# EAGLE board moteus_n1 (EAGLE 9.6.0), part 1 of 2
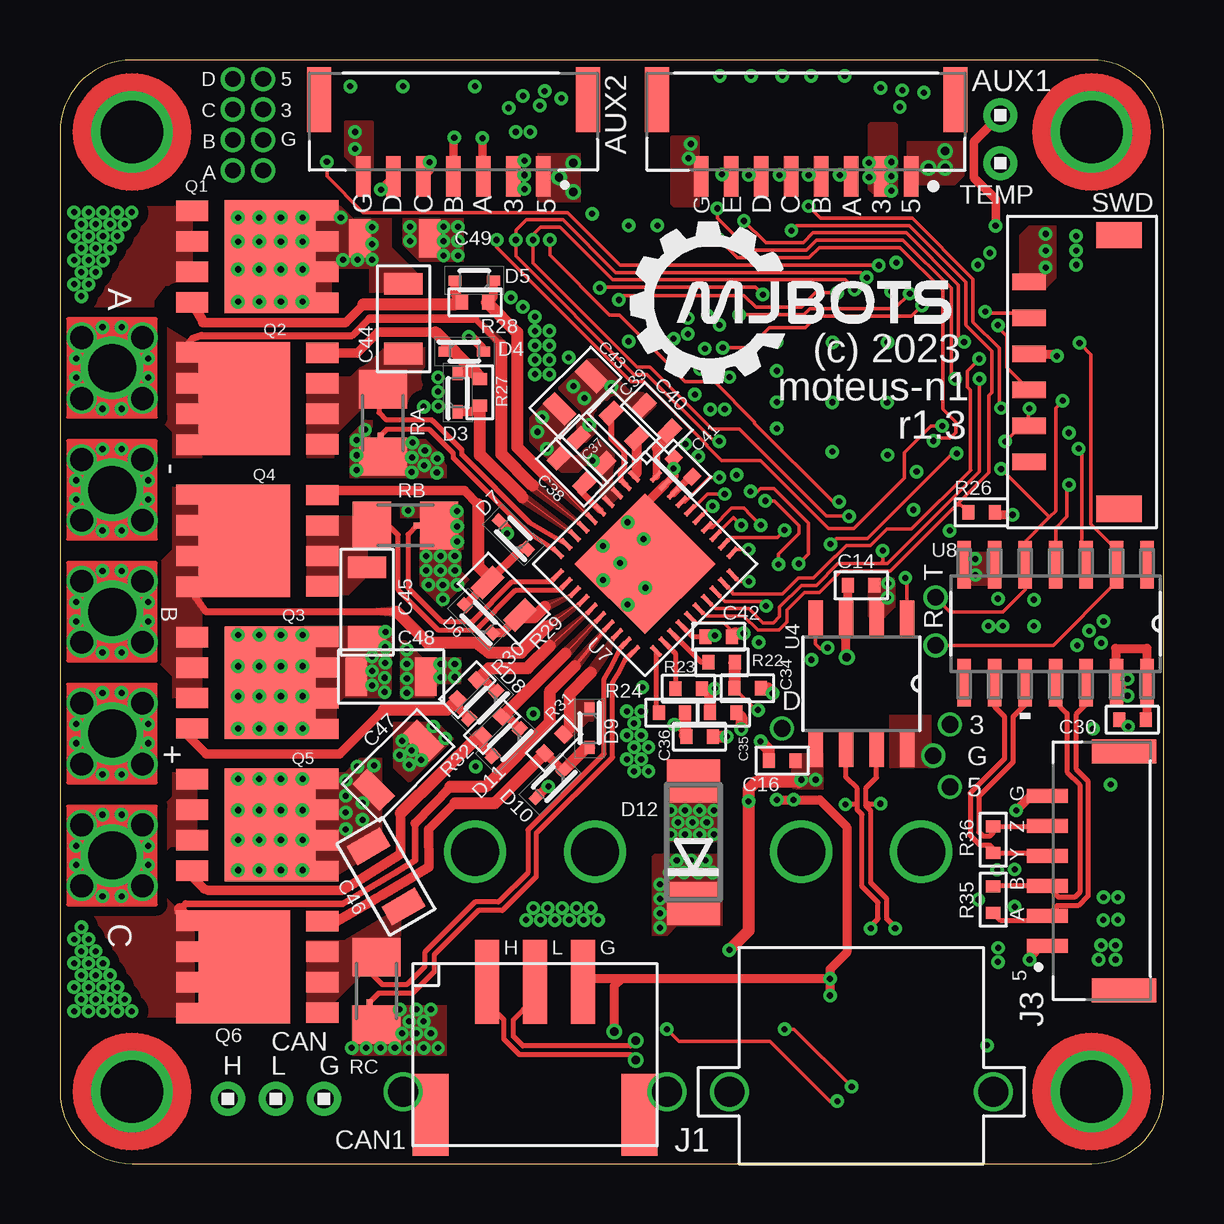
[diagram p8: board, top side]
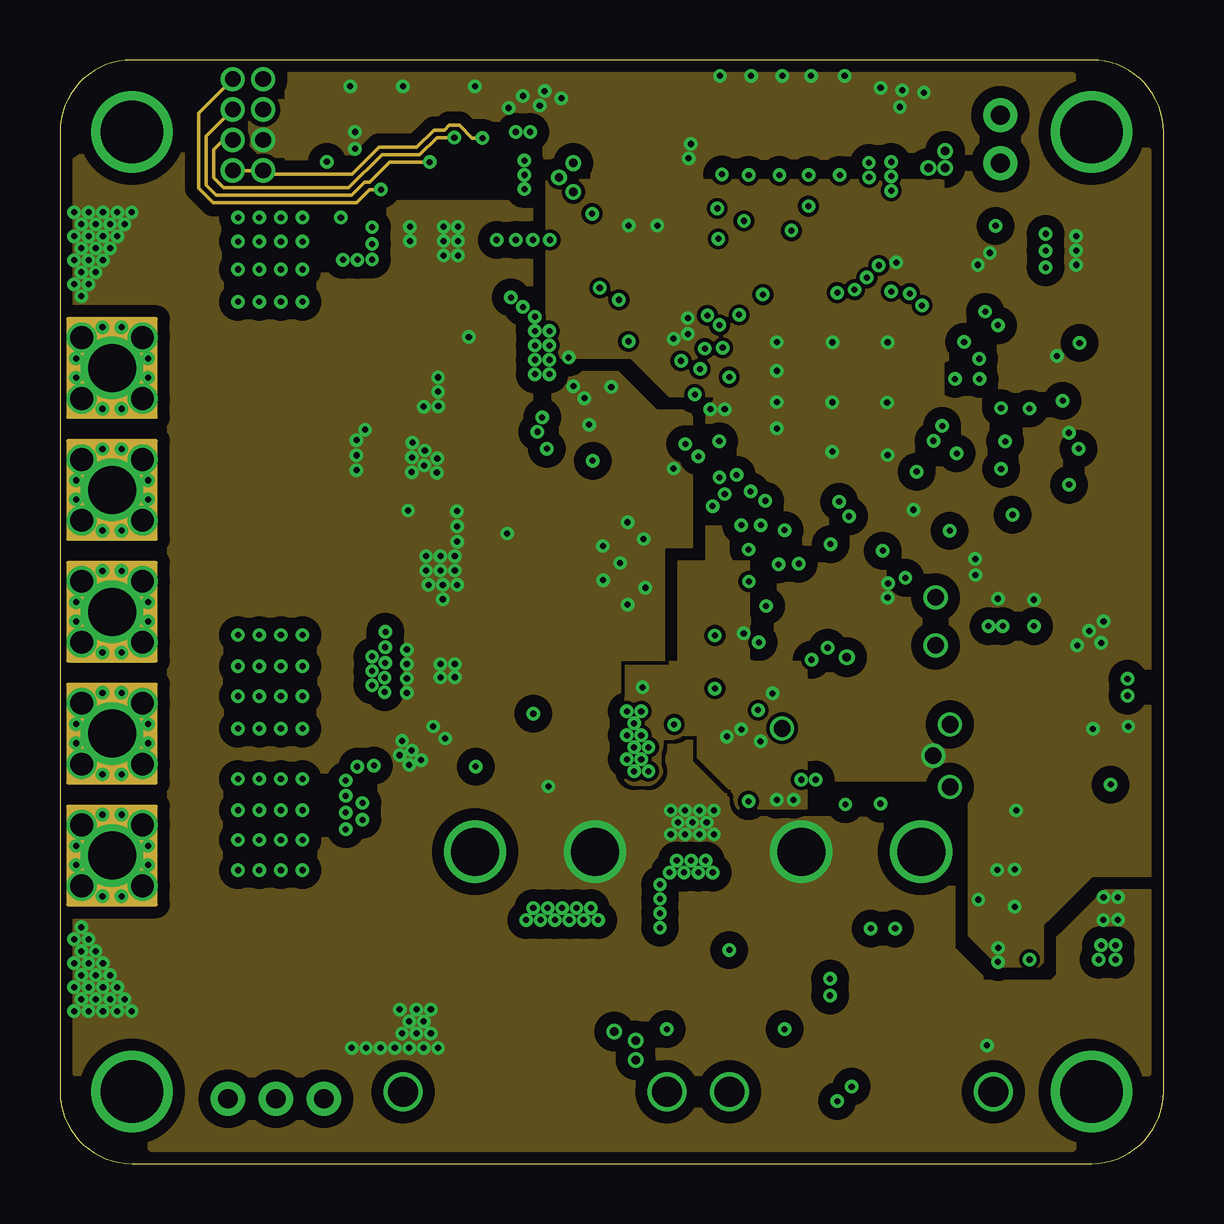
[diagram p9: board, inner layer Route2]
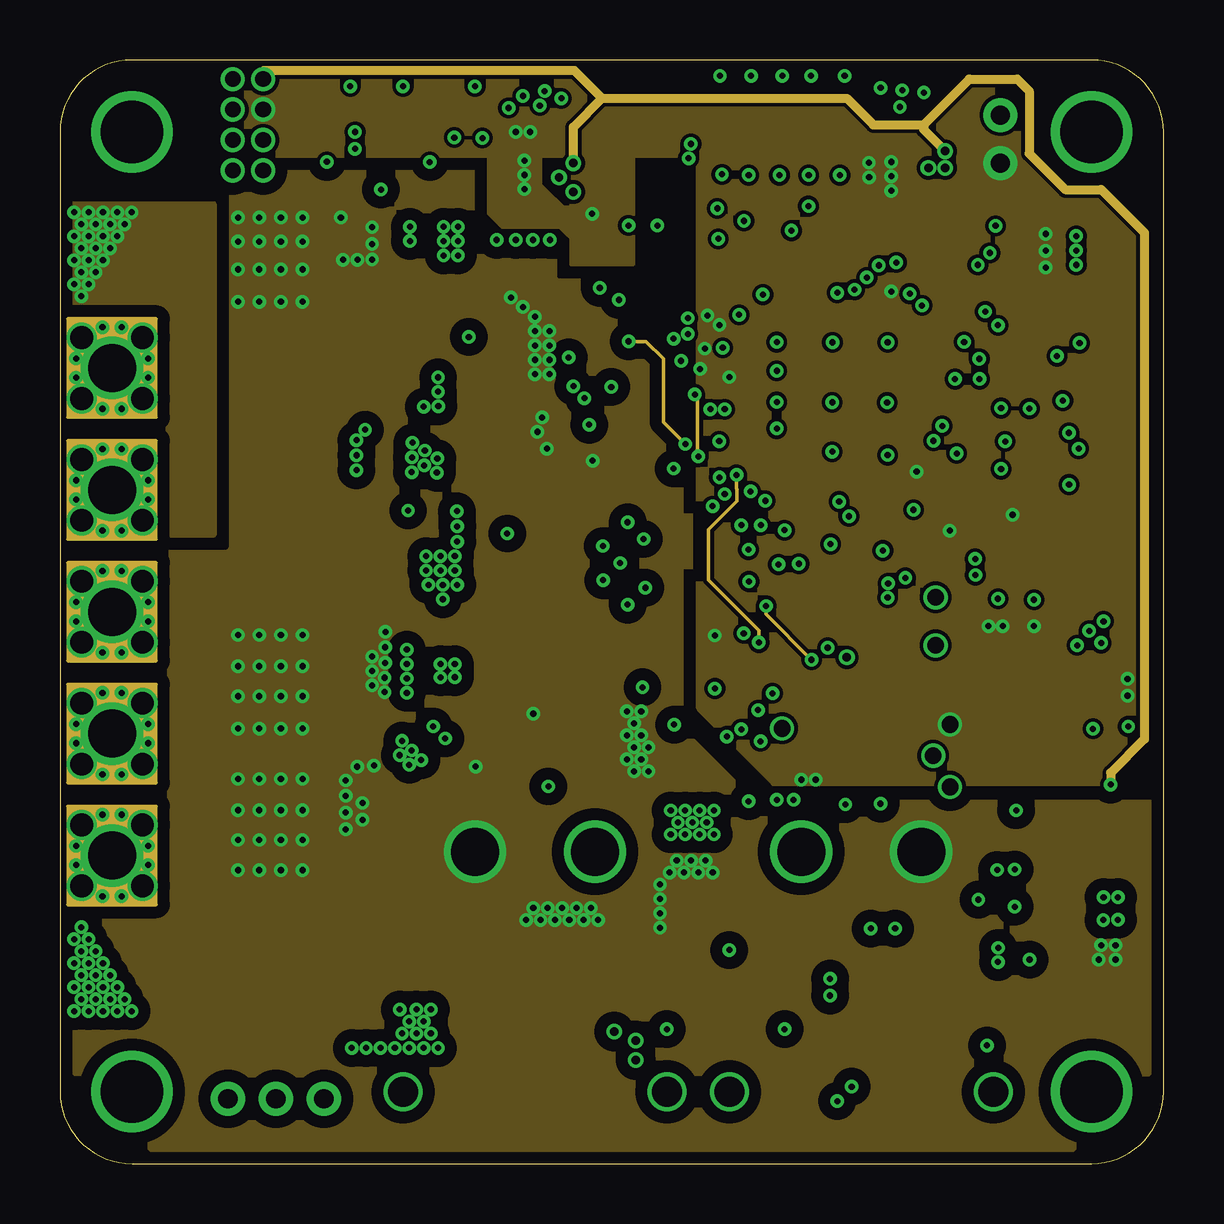
[diagram p10: board, inner layer Route15]
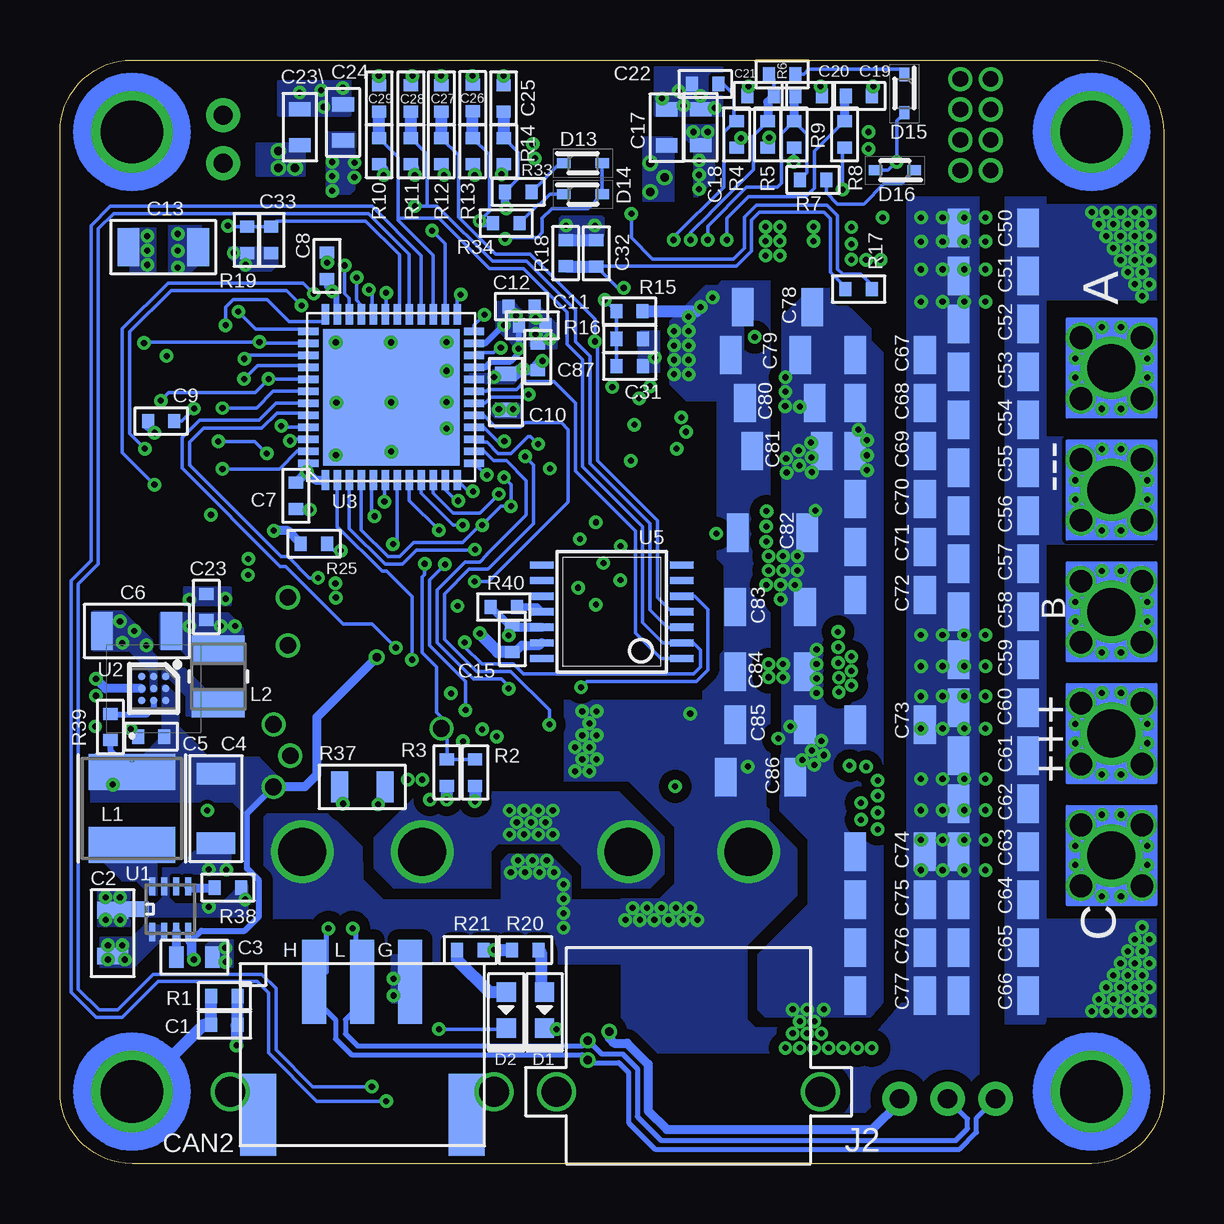
[diagram p11: board, bottom side, seen from below]

Size 46 x 46 mm. Coordinates in mm from the lower left corner, seen from the top.
Outline: 0,43 0,3 arc90 3,0 43,0 arc90 46,3 46,43 arc90 43,46 3,46 arc90 0,43
Copper layers (1*2*15*16): Top 0.07mm / dielectric 0.23mm / Route2 0.035mm / dielectric 0.93mm / Route15 0.035mm / dielectric 0.23mm / Bottom 0.07mm
Design rules "MF_4_mil_drill_4_Layer *": minimum track width 6mil, minimum drill 10mil, track to track 6mil, track to pad 6mil, pad to pad 6mil, via to via 6mil, smd to smd 0mil, copper to edge 10mil, drill to drill 10mil, minimum pad ring 6mil, minimum via ring 6mil, stop-mask expansion 2mil, vias tented up to drill 25mil, thermal gap 10mil
Net classes: 0 default: width 0.127 mm; 1 CAN: width 0.216 mm, clearance 0.127 mm; 2 HV: clearance 0.13 mm; 3 GATE: width 0.384 mm

## Footprints (pad centres in the part's own frame; a part is rotated, then mirrored left to right if it is on the bottom)
16AWG_TERM = drill 2: 1 0,0 | drill 0.254: 2 -1.7,0.4; 3 -1.7,-0.4; 4 1.7,0.4; 5 1.7,-0.4; 6 -0.4,1.5; 7 0.4,1.5; 8 -0.4,-1.5; 9 0.4,-1.5 | drill 0.95 pad 1.255: 10 -1.27,1.27; 11 1.27,1.27; 12 -1.27,-1.27; 13 1.27,-1.27
JST_SM08B-GHS-TB(LF)(SN) = smd 0.6 x 1.7: 1 -4.375,0; 2 -3.125,0; 3 -1.875,0; 4 -0.625,0; 5 0.625,0; 6 1.875,0; 7 3.125,0; 8 4.375,0 | smd 1 x 2.7: SH1 -6.225,-3.2; SH2 6.225,-3.2
JST_SM07B-GHS-TB(LF)(SN) = smd 0.6 x 1.7: 1 -3.75,1.85; 2 -2.5,1.85; 3 -1.25,1.85; 4 0,1.85; 5 1.25,1.85; 6 2.5,1.85; 7 3.75,1.85 | smd 1 x 2.7: S1 5.6,-1.35; S2 -5.6,-1.35
PH2X4 = drill 0.65 pad 1.016: P$1 0,0; P$2 1.27,0; P$3 0,-1.27; P$4 1.27,-1.27; P$5 0,-2.54; P$6 1.27,-2.54; P$7 0,-3.81; P$8 1.27,-3.81
C0402 = smd 0.5 x 0.6: P$1 -0.55,0; P$2 0.55,0
C0805 = smd 0.7 x 1.3: P$1 -0.95,0; P$2 0.95,0
C0603 = smd 0.6 x 0.9: P$1 -0.75,0; P$2 0.75,0
C1206 = smd 0.9 x 1.6: P$1 -1.45,0; P$2 1.45,0
C1206_NOBORDER = smd 0.9 x 1.6: P$1 -1.45,0; P$2 1.45,0
JST_S3B-PH-SM4-TB(LF)(SN) = smd 1 x 3.5: 1 2,-2.98; 2 0,-2.98; 3 -2,-2.98 | smd 1.5 x 3.4: S1 -4.35,2.57; S2 4.35,2.57
1X3 = drill 0.8 pad 1.422: 1 -2,0; 2 0,0; 3 2,0
LED0603 = smd 0.8 x 0.8: ANODE 0.75,0; CATHODE -0.75,0
SODFL1608X70N = smd 0.55 x 0.42: 1 -0.8,0; 2 0.8,0
DO214AA = smd 1.8 x 2.2: A 2.55,0; C -2.55,0
24AWG_PAD = drill 0.7: P$1 0,0
XT30PW_MALE = drill 2: 1 -2.5,0; 2 2.5,0 | drill 1.25: M1 -5.5,10; M2 5.5,10
JST_SM06B-GHS-TB(LF)(SN) = smd 0.6 x 1.7: 1 -3.125,1.85; 2 -1.875,1.85; 3 -0.625,1.85; 4 0.625,1.85; 5 1.875,1.85; 6 3.125,1.85 | smd 1 x 2.7: S1 4.975,-1.35; S2 -4.975,-1.35
IND_BOURNS_SRN4018 = smd 1.499 x 3.607: 1 -1.524,0; 2 1.524,0
IND_1008_WE-PMI_WRE = smd 1.168 x 2.21: 1 -1.118,0; 2 1.118,0
M2.5MOUNT = drill 2.6: P$1 0,0
SOP_ADVANCE_8_VIAS = smd 0.85 x 1.35: 1 -1.905,-2.9; 2 -0.635,-2.9; 3 0.635,-2.9; 4 1.905,-2.9 | smd 0.85 x 1: 5 1.925,2.7; 6 0.637,2.7; 7 -0.637,2.7; 8 -1.925,2.7 | smd 4.7 x 3.8: PAD 0,0.35
SOP_ADVANCE_8 = smd 0.85 x 1.35: 1 -1.905,-2.9; 2 -0.635,-2.9; 3 0.635,-2.9; 4 1.905,-2.9 | smd 0.85 x 1: 5 1.925,2.7; 6 0.637,2.7; 7 -0.637,2.7; 8 -1.925,2.7 | smd 4.7 x 3.8: PAD 0,0.35
R0402 = smd 0.5 x 0.6: P$1 -0.55,0; P$2 0.55,0
R0805 = smd 0.7 x 1.3: P$1 -0.95,0; P$2 0.95,0
M1206 = smd 1.6 x 2: 1 -1.4,0; 2 1.4,0
SHORT_TOP-50 = smd 0.254 x 0.254: 1 0.127,0; 2 -0.127,0
SHORT_TOP-MEDIUM = smd 0.635 x 0.635: 1 0.318,0; 2 -0.318,0
JST_S6B-ZR-SM4A-TF(LF)(SN) = smd 0.7 x 1.4: 1 3.75,0; 2 2.25,0; 3 0.75,0; 4 -0.75,0; 5 -2.25,0; 6 -3.75,0 | smd 1.1 x 1.9: P1 5.7,3.75; P2 -5.7,3.75
1X2 = drill 0.8 pad 1.422: 1 -1,0; 2 1,0
21-0487A_MXM = smd 0.762 x 0.254: 1 -0.953,0.75; 2 -0.953,0.25; 3 -0.953,-0.25; 4 -0.953,-0.75; 5 0.953,-0.75; 6 0.953,-0.25; 7 0.953,0.25; 8 0.953,0.75
BGA9C50P3X3_165X187X66 = smd 0.306 x 0.306: A1 -0.5,0.5; A2 0,0.5; A3 0.5,0.5; B1 -0.5,0; B2 0,0; B3 0.5,0; C1 -0.5,-0.5; C2 0,-0.5; C3 0.5,-0.5
QFN50P700X700X60-49N = smd 0.85 x 0.3: 1 -3.45,2.75; 2 -3.45,2.25; 3 -3.45,1.75; 4 -3.45,1.25; 5 -3.45,0.75; 6 -3.45,0.25; 7 -3.45,-0.25; 8 -3.45,-0.75; 9 -3.45,-1.25; 10 -3.45,-1.75; 11 -3.45,-2.25; 12 -3.45,-2.75; 25 3.45,-2.75; 26 3.45,-2.25; 27 3.45,-1.75; 28 3.45,-1.25; 29 3.45,-0.75; 30 3.45,-0.25; 31 3.45,0.25; 32 3.45,0.75; 33 3.45,1.25; 34 3.45,1.75; 35 3.45,2.25; 36 3.45,2.75 | smd 0.3 x 0.85: 13 -2.75,-3.45; 14 -2.25,-3.45; 15 -1.75,-3.45; 16 -1.25,-3.45; 17 -0.75,-3.45; 18 -0.25,-3.45; 19 0.25,-3.45; 20 0.75,-3.45; 21 1.25,-3.45; 22 1.75,-3.45; 23 2.25,-3.45; 24 2.75,-3.45; 37 2.75,3.45; 38 2.25,3.45; 39 1.75,3.45; 40 1.25,3.45; 41 0.75,3.45; 42 0.25,3.45; 43 -0.25,3.45; 44 -0.75,3.45; 45 -1.25,3.45; 46 -1.75,3.45; 47 -2.25,3.45; 48 -2.75,3.45 | smd 5.7 x 5.7: 49 0,0
SOIC8 = smd 1.549 x 0.61: 1 -2.7,1.905; 2 -2.7,0.635; 3 -2.7,-0.635; 4 -2.7,-1.905; 5 2.7,-1.905; 6 2.7,-0.635; 7 2.7,0.635; 8 2.7,1.905
TSSOP14 = smd 0.305 x 0.991: 1 -1.95,-2.918; 2 -1.3,-2.918; 3 -0.65,-2.918; 4 0,-2.918; 5 0.65,-2.918; 6 1.3,-2.918; 7 1.95,-2.918; 8 1.95,2.918; 9 1.3,2.918; 10 0.65,2.918; 11 0,2.918; 12 -0.65,2.918; 13 -1.3,2.918; 14 -1.95,2.918
WQFN-40 = smd 0.22 x 0.6: 1 2.25,2.9; 2 1.75,2.9; 3 1.25,2.9; 4 0.75,2.9; 5 0.25,2.9; 6 -0.25,2.9; 7 -0.75,2.9; 8 -1.25,2.9; 9 -1.75,2.9; 10 -2.25,2.9; 21 -2.25,-2.9; 22 -1.75,-2.9; 23 -1.25,-2.9; 24 -0.75,-2.9; 25 -0.25,-2.9; 26 0.25,-2.9; 27 0.75,-2.9; 28 1.25,-2.9; 29 1.75,-2.9; 30 2.25,-2.9 | smd 0.6 x 0.22: 11 -2.9,2.25; 12 -2.9,1.75; 13 -2.9,1.25; 14 -2.9,0.75; 15 -2.9,0.25; 16 -2.9,-0.25; 17 -2.9,-0.75; 18 -2.9,-1.25; 19 -2.9,-1.75; 20 -2.9,-2.25; 31 2.9,-2.25; 32 2.9,-1.75; 33 2.9,-1.25; 34 2.9,-0.75; 35 2.9,-0.25; 36 2.9,0.25; 37 2.9,0.75; 38 2.9,1.25; 39 2.9,1.75; 40 2.9,2.25 | smd 4.15 x 4.15: PAD 0,0
D14 = smd 1.981 x 0.559: 1 -2.464,3.81; 2 -2.464,2.54; 3 -2.464,1.27; 4 -2.464,0; 5 -2.464,-1.27; 6 -2.464,-2.54; 7 -2.464,-3.81; 8 2.464,-3.81; 9 2.464,-2.54; 10 2.464,-1.27; 11 2.464,0; 12 2.464,1.27; 13 2.464,2.54; 14 2.464,3.81

## Placement (x,y rotation side)
A  PAD16AWG_TERM  [16AWG_TERM]  2.17,33.16 90 bottom
AUX1  SM08B-GHS-TB(LF)(SN)  [JST_SM08B-GHS-TB(LF)(SN)]  31.1,41.15 180 top
AUX2  SM07B-GHS-TB(LF)(SN)  [JST_SM07B-GHS-TB(LF)(SN)]  16.4,43 180 top
AUX2H  PH2X4  [PH2X4]  7.2,45.2 0 top
B  PAD16AWG_TERM  [16AWG_TERM]  2.17,23 90 bottom
C  PAD16AWG_TERM  [16AWG_TERM]  2.17,12.84 90 bottom
C1  DNP  [C0402]  39.15,5.78 0 bottom
C2  1uF 100V  [C0805]  43.8,9.6 90 bottom
C3  1uF  [C0603]  40.4,8.6 0 bottom
C4  22uF  [C1206]  39.5,14.8 270 bottom
C5  1uF  [C0402]  42.2,17.8 180 bottom
C6  22uF  [C1206]  42.8,22.2 180 bottom
C7  0.1uF  [C0402]  36.16,27.83 270 bottom
C8  0.1uF  [C0402]  34.87,37.42 90 bottom
C9  0.1uF  [C0402]  41.78,30.95 180 bottom
C10  4.7uF  [C0603]  27.41,32.16 270 bottom
C11  1uF  [C0402]  26.31,34.94 0 bottom
C12  0.1uF  [C0402]  26.76,35.72 0 bottom
C13  10uF  [C1206]  41.69,38.2 0 bottom
C14  0.1uF  [C0402]  33.4,24.1 0 top
C15  0.1uF  [C0402]  27.14,21.87 270 bottom
C16  0.1uF  [C0402]  30.1,16.8 180 top
C17  1uF  [C0603]  20.71,43.18 90 bottom
C18  1uF  [C0603]  19.3,43.2 90 bottom
C19  DNP  [C0402]  12.7,44.5 0 bottom
C20  DNP  [C0402]  14.8,44.5 0 bottom
C21  DNP  [C0402]  16.8,44.5 180 bottom
C22  DNP  [C0402]  19.1,45 180 bottom
C23  1uF  [C0402]  39.9,23.2 90 bottom
C23\  1uF  [C0603]  36,43.2 90 bottom
C24  1uF  [C0603]  34.2,43.4 90 bottom
C25  DNP  [C0402]  27.51,44.4 90 bottom
C26  DNP  [C0402]  28.8,44.41 90 bottom
C27  DNP  [C0402]  30.1,44.4 90 bottom
C28  DNP  [C0402]  31.37,44.4 90 bottom
C29  DNP  [C0402]  32.7,44.4 90 bottom
C30  0.1uF  [C0402]  44.7,18.5 180 top
C31  0.01uF  [C0402]  22.25,33.24 0 bottom
C32  0.1uF  [C0402]  23.64,37.94 90 bottom
C33  0.1uF  [C0402]  37.2,38.5 270 bottom
C34  1000pF  [C0402]  28.66,19.81 0 top
C35  1000pF  [C0402]  27.65,18.79 0 top
C36  1000pF  [C0402]  26.66,17.79 0 top
C37  0.1uF 100V  [C0603]  22.14,29.71 135 top
C38  1uF  [C0603]  21.34,28.88 315 top
C39  0.1uF 100V  [C0603]  23.51,30.75 315 top
C40  1uF  [C0603]  24.88,31.07 315 top
C41  1uF  [C0402]  25.97,29.01 315 top
C42  0.1uF  [C0402]  27.46,21.96 180 top
C43  0.47uF 100V  [C0805]  21.49,32.13 45 top
C44  0.1uF 100V  [C1206]  14.32,35.21 270 top
C45  0.1uF 100V  [C1206]  12.8,23.4 90 top
C46  0.1uF 100V  [C1206]  13.59,11.97 300 top
C47  4.7uF 100V  [C1206]  14.1,16.6 45 top
C48  4.7uF 100V  [C1206]  13.8,20.3 0 top
C49  4.7uF 100V  [C1206_NOBORDER]  13.96,38.57 0 top
C50  4.7uF 100V  [C1206_NOBORDER]  7.1,39 0 bottom
C51  4.7uF 100V  [C1206_NOBORDER]  7.1,37 0 bottom
C52  4.7uF 100V  [C1206_NOBORDER]  7.1,35 0 bottom
C53  4.7uF 100V  [C1206_NOBORDER]  7.1,33 0 bottom
C54  4.7uF 100V  [C1206_NOBORDER]  7.1,31 0 bottom
C55  4.7uF 100V  [C1206_NOBORDER]  7.1,29 0 bottom
C56  4.7uF 100V  [C1206_NOBORDER]  7.1,27 0 bottom
C57  4.7uF 100V  [C1206_NOBORDER]  7.1,25 0 bottom
C58  4.7uF 100V  [C1206_NOBORDER]  7.1,23 0 bottom
C59  4.7uF 100V  [C1206_NOBORDER]  7.1,21 0 bottom
C60  4.7uF 100V  [C1206_NOBORDER]  7.1,19 0 bottom
C61  4.7uF 100V  [C1206_NOBORDER]  7.1,17 0 bottom
C62  4.7uF 100V  [C1206_NOBORDER]  7.1,15 0 bottom
C63  4.7uF 100V  [C1206_NOBORDER]  7.1,13 0 bottom
C64  4.7uF 100V  [C1206_NOBORDER]  7.1,11 0 bottom
C65  4.7uF 100V  [C1206_NOBORDER]  7.1,9 0 bottom
C66  4.7uF 100V  [C1206_NOBORDER]  7.1,7 0 bottom
C67  4.7uF 100V  [C1206_NOBORDER]  11.4,33.7 180 bottom
C68  4.7uF 100V  [C1206_NOBORDER]  11.4,31.7 180 bottom
C69  4.7uF 100V  [C1206_NOBORDER]  11.4,29.7 180 bottom
C70  4.7uF 100V  [C1206_NOBORDER]  11.4,27.7 180 bottom
C71  4.7uF 100V  [C1206_NOBORDER]  11.4,25.7 180 bottom
C72  4.7uF 100V  [C1206_NOBORDER]  11.4,23.7 180 bottom
C73  4.7uF 100V  [C1206_NOBORDER]  11.4,18.3 180 bottom
C74  4.7uF 100V  [C1206_NOBORDER]  11.4,13 180 bottom
C75  4.7uF 100V  [C1206_NOBORDER]  11.4,11 180 bottom
C76  4.7uF 100V  [C1206_NOBORDER]  11.4,9 180 bottom
C77  4.7uF 100V  [C1206_NOBORDER]  11.4,7 180 bottom
C78  4.7uF 100V  [C1206_NOBORDER]  16.1,35.7 0 bottom
C79  4.7uF 100V  [C1206_NOBORDER]  16.6,33.7 0 bottom
C80  4.7uF 100V  [C1206_NOBORDER]  16,31.7 0 bottom
C81  4.7uF 100V  [C1206_NOBORDER]  15.7,29.7 0 bottom
C82  4.7uF 100V  [C1206_NOBORDER]  16.3,26.3 0 bottom
C83  4.7uF 100V  [C1206_NOBORDER]  16.4,23.2 0 bottom
C84  4.7uF 100V  [C1206_NOBORDER]  16.4,20.5 0 bottom
C85  4.7uF 100V  [C1206_NOBORDER]  16.4,18.3 0 bottom
C86  4.7uF 100V  [C1206_NOBORDER]  16.8,16.1 0 bottom
C87  0.1uF  [C0402]  26.08,33.62 90 bottom
CAN1  JST-PH3  [JST_S3B-PH-SM4-TB(LF)(SN)]  19.8,4.6 180 top
CAN2  JST-PH3  [JST_S3B-PH-SM4-TB(LF)(SN)]  33.4,4.6 180 bottom
CAN_DBG  1X3  [1X3]  9,2.7 0 top
D1  MF-LED-0603-RED  [LED0603]  25.8,6.4 90 bottom
D2  MF-LED-0603-RED  [LED0603]  27.4,6.4 90 bottom
D3  BAT41KFILM  [SODFL1608X70N]  16.58,32.13 90 top
D4  BAT41KFILM  [SODFL1608X70N]  16.86,33.85 0 top
D5  BAT41KFILM  [SODFL1608X70N]  17.27,36.81 180 top
D6  BAT41KFILM  [SODFL1608X70N]  17.45,22.7 135 top
D7  BAT41KFILM  [SODFL1608X70N]  18.9,26.2 135 top
D8  BAT41KFILM  [SODFL1608X70N]  17.62,19.11 225 top
D9  BAT41KFILM  [SODFL1608X70N]  22.07,18.14 270 top
D10  BAT41KFILM  [SODFL1608X70N]  20.43,15.83 225 top
D11  BAT41KFILM  [SODFL1608X70N]  18.61,17.54 225 top
D12  [DO214AA]  26.4,13.4 90 top
D13  BAT41KFILM  [SODFL1608X70N]  24.2,41.7 0 bottom
D14  BAT41KFILM  [SODFL1608X70N]  24.2,40.4 0 bottom
D15  BAT41KFILM  [SODFL1608X70N]  10.8,44.6 270 bottom
D16  BAT41KFILM  [SODFL1608X70N]  11.2,41.4 180 bottom
D33  PAD24AWG_PAD  [24AWG_PAD]  37.1,18.3 0 top
D50  PAD24AWG_PAD  [24AWG_PAD]  37.1,15.7 0 top
DAC  PAD24AWG_PAD  [24AWG_PAD]  30.1,18.14 180 top
DG1  PAD24AWG_PAD  [24AWG_PAD]  36.4,17 0 top
DTR  PAD24AWG_PAD  [24AWG_PAD]  36.5,21.6 0 top
DTX  PAD24AWG_PAD  [24AWG_PAD]  36.5,23.6 0 top
J1  XT30XT30PW_MALE  [XT30PW_MALE]  33.4,13 180 top
J2  XT30XT30PW_MALE  [XT30PW_MALE]  19.8,13 180 bottom
J3  SM06B-GHS-TB(LF)(SN)  [JST_SM06B-GHS-TB(LF)(SN)]  43,12.2 90 top
L1  SRN4018-220M  [IND_BOURNS_SRN4018]  43,14.8 270 bottom
L2  74479887222A  [IND_1008_WE-PMI_WRE]  39.4,20.3 270 bottom
M1  MOUNT  [M2.5MOUNT]  3,3 0 top
M2  MOUNT  [M2.5MOUNT]  3,43 0 top
M3  MOUNT  [M2.5MOUNT]  43,3 0 top
M4  MOUNT  [M2.5MOUNT]  43,43 0 top
Q1  TPH1R204PL_VIAS  [SOP_ADVANCE_8_VIAS]  8.41,37.8 270 top
Q2  TPH1R204PLSOP_ADVANCE_8  [SOP_ADVANCE_8]  8.04,31.88 90 top
Q3  TPH1R204PL_VIAS  [SOP_ADVANCE_8_VIAS]  8.41,20.04 270 top
Q4  TPH1R204PLSOP_ADVANCE_8  [SOP_ADVANCE_8]  8.04,25.96 90 top
Q5  TPH1R204PL_VIAS  [SOP_ADVANCE_8_VIAS]  8.41,14.12 270 top
Q6  TPH1R204PLSOP_ADVANCE_8  [SOP_ADVANCE_8]  8.04,8.2 90 top
R1  DNP  [R0402]  39.15,6.98 0 bottom
R2  100k 1%  [R0402]  28.7,16.3 270 bottom
R3  DNP  [R0402]  29.87,16.3 90 bottom
R4  100  [R0402]  17.8,42.9 90 bottom
R5  100  [R0402]  16.5,42.9 90 bottom
R6  2k  [R0402]  15.9,45.4 180 bottom
R7  2k  [R0402]  14.61,41 180 bottom
R8  100  [R0402]  13.3,42.9 90 bottom
R9  100  [R0402]  15.4,42.9 90 bottom
R10  100  [R0402]  32.7,42.2 90 bottom
R11  100  [R0402]  31.37,42.2 90 bottom
R12  100  [R0402]  30.11,42.2 90 bottom
R13  100  [R0402]  28.8,42.2 90 bottom
R14  100  [R0402]  27.5,42.2 90 bottom
R15  100k 1%  [R0402]  22.26,35.53 0 bottom
R16  4.7k 1%  [R0402]  22.25,34.37 180 bottom
R17  47k NTC  [R0402]  12.71,36.45 180 bottom
R18  10k 1%  [R0402]  24.92,37.95 90 bottom
R19  10k 1%  [R0402]  38.2,38.5 270 bottom
R20  560  [R0402]  26.6,8.9 0 bottom
R21  560  [R0402]  28.9,8.9 180 bottom
R22  22  [R0402]  27.59,20.9 0 top
R23  22  [R0402]  26.2,19.8 0 top
R24  22  [R0402]  25.51,18.8 0 top
R25  2k  [R0402]  35.41,25.84 0 bottom
R26  2k  [R0402]  38.41,27.14 180 top
R27  7.5  [R0402]  17.5,32.15 90 top
R28  7.5  [R0402]  17.3,35.9 180 top
R29  7.5  [R0805]  18.5,23.54 135 top
R30  7.5  [R0402]  16.98,19.75 225 top
R31  7.5  [R0402]  20.6,17.5 225 top
R32  7.5  [R0402]  18.02,18.24 225 top
R33  2k  [R0402]  26.9,40.5 180 bottom
R34  2k  [R0402]  27.4,39.2 180 bottom
R35  120  [R0402]  38.9,11 270 top
R36  120  [R0402]  38.9,13.5 270 top
R37  DNP  [R0805]  33.4,15.7 0 bottom
R38  0  [R0402]  39,11.5 180 bottom
R39  0  [R0402]  43.9,18.2 270 bottom
R40  0  [R0402]  27.5,23.2 180 bottom
RA  0.5mOhm 1% 2W  [M1206]  13.46,30.87 90 top
RB  0.5mOhm 1% 2W  [M1206]  14.4,26.6 180 top
RC  0.5mOhm 1% 2W  [M1206]  13.2,7.2 90 top
SH1  SHORTT5  [SHORT_TOP-50]  13.36,30.22 90 top
SH2  SHORTT5  [SHORT_TOP-50]  15,26.6 180 top
SH3  SHORTT5  [SHORT_TOP-50]  12.9,6.6 90 top
SH4  SHORTMEDIUM  [SHORT_TOP-MEDIUM]  42.94,10.6 180 bottom
SWD  JST-ZH6  [JST_S6B-ZR-SM4A-TF(LF)(SN)]  40.4,33 270 top
TEMP  1X2  [1X2]  39.2,42.7 90 top
U1  MAX15062AATA+T  [21-0487A_MXM]  41.4,10.6 90 bottom
U2  ADP5301ACBZ-4-R7  [BGA9C50P3X3_165X187X66]  42.1,19.8 270 bottom
U3  STM32G474CEU6  [QFN50P700X700X60-49N]  32.19,31.94 90 bottom
U4  TCAN1042HGV  [SOIC8]  33.4,20 270 top
U5  AS5147  [TSSOP14]  23,23 90 bottom
U7  DRV8353S  [WQFN-40]  24.39,25 45 top
U8  SN65HVD35DR  [D14]  41.5,22.5 270 top
VN  PAD16AWG_TERM  [16AWG_TERM]  2.17,28.08 90 bottom
VP  PAD16AWG_TERM  [16AWG_TERM]  2.17,17.92 90 bottom